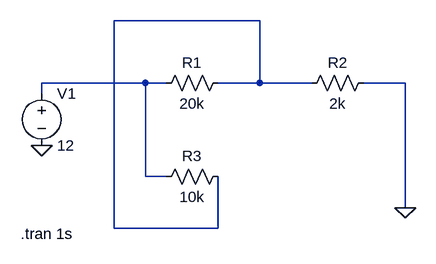
[diagram p0: schematic jdq.asc]
jdq.asc, the LTspice schematic file:
Version 4.1
SHEET 1 880 680
WIRE 368 -32 144 -32
WIRE 192 64 32 64
WIRE 224 64 192 64
WIRE 368 64 368 -32
WIRE 368 64 304 64
WIRE 448 64 368 64
WIRE 592 64 528 64
WIRE 32 80 32 64
WIRE 192 208 192 64
WIRE 224 208 192 208
WIRE 592 256 592 64
WIRE 144 288 144 -32
WIRE 304 288 304 208
WIRE 304 288 144 288
FLAG 32 160 0
FLAG 592 256 0
SYMBOL voltage 32 64 R0
WINDOW 123 0 0 Left 0
WINDOW 39 0 0 Left 0
SYMATTR InstName V1
SYMATTR Value 12
SYMBOL res 320 48 R90
WINDOW 0 0 56 VBottom 2
WINDOW 3 32 56 VTop 2
SYMATTR InstName R1
SYMATTR Value 20k
SYMBOL res 544 48 R90
WINDOW 0 0 56 VBottom 2
WINDOW 3 32 56 VTop 2
SYMATTR InstName R2
SYMATTR Value 2k
SYMBOL res 320 192 R90
WINDOW 0 0 56 VBottom 2
WINDOW 3 32 56 VTop 2
SYMATTR InstName R3
SYMATTR Value 10k
TEXT 0 296 Left 2 !.tran 1s

The netlist it stands for:
* jdq.asc
V1 N002 0 12
R1 N001 N002 20k
R2 0 N001 2k
R3 N001 N002 10k
.tran 1s
.backanno
.end